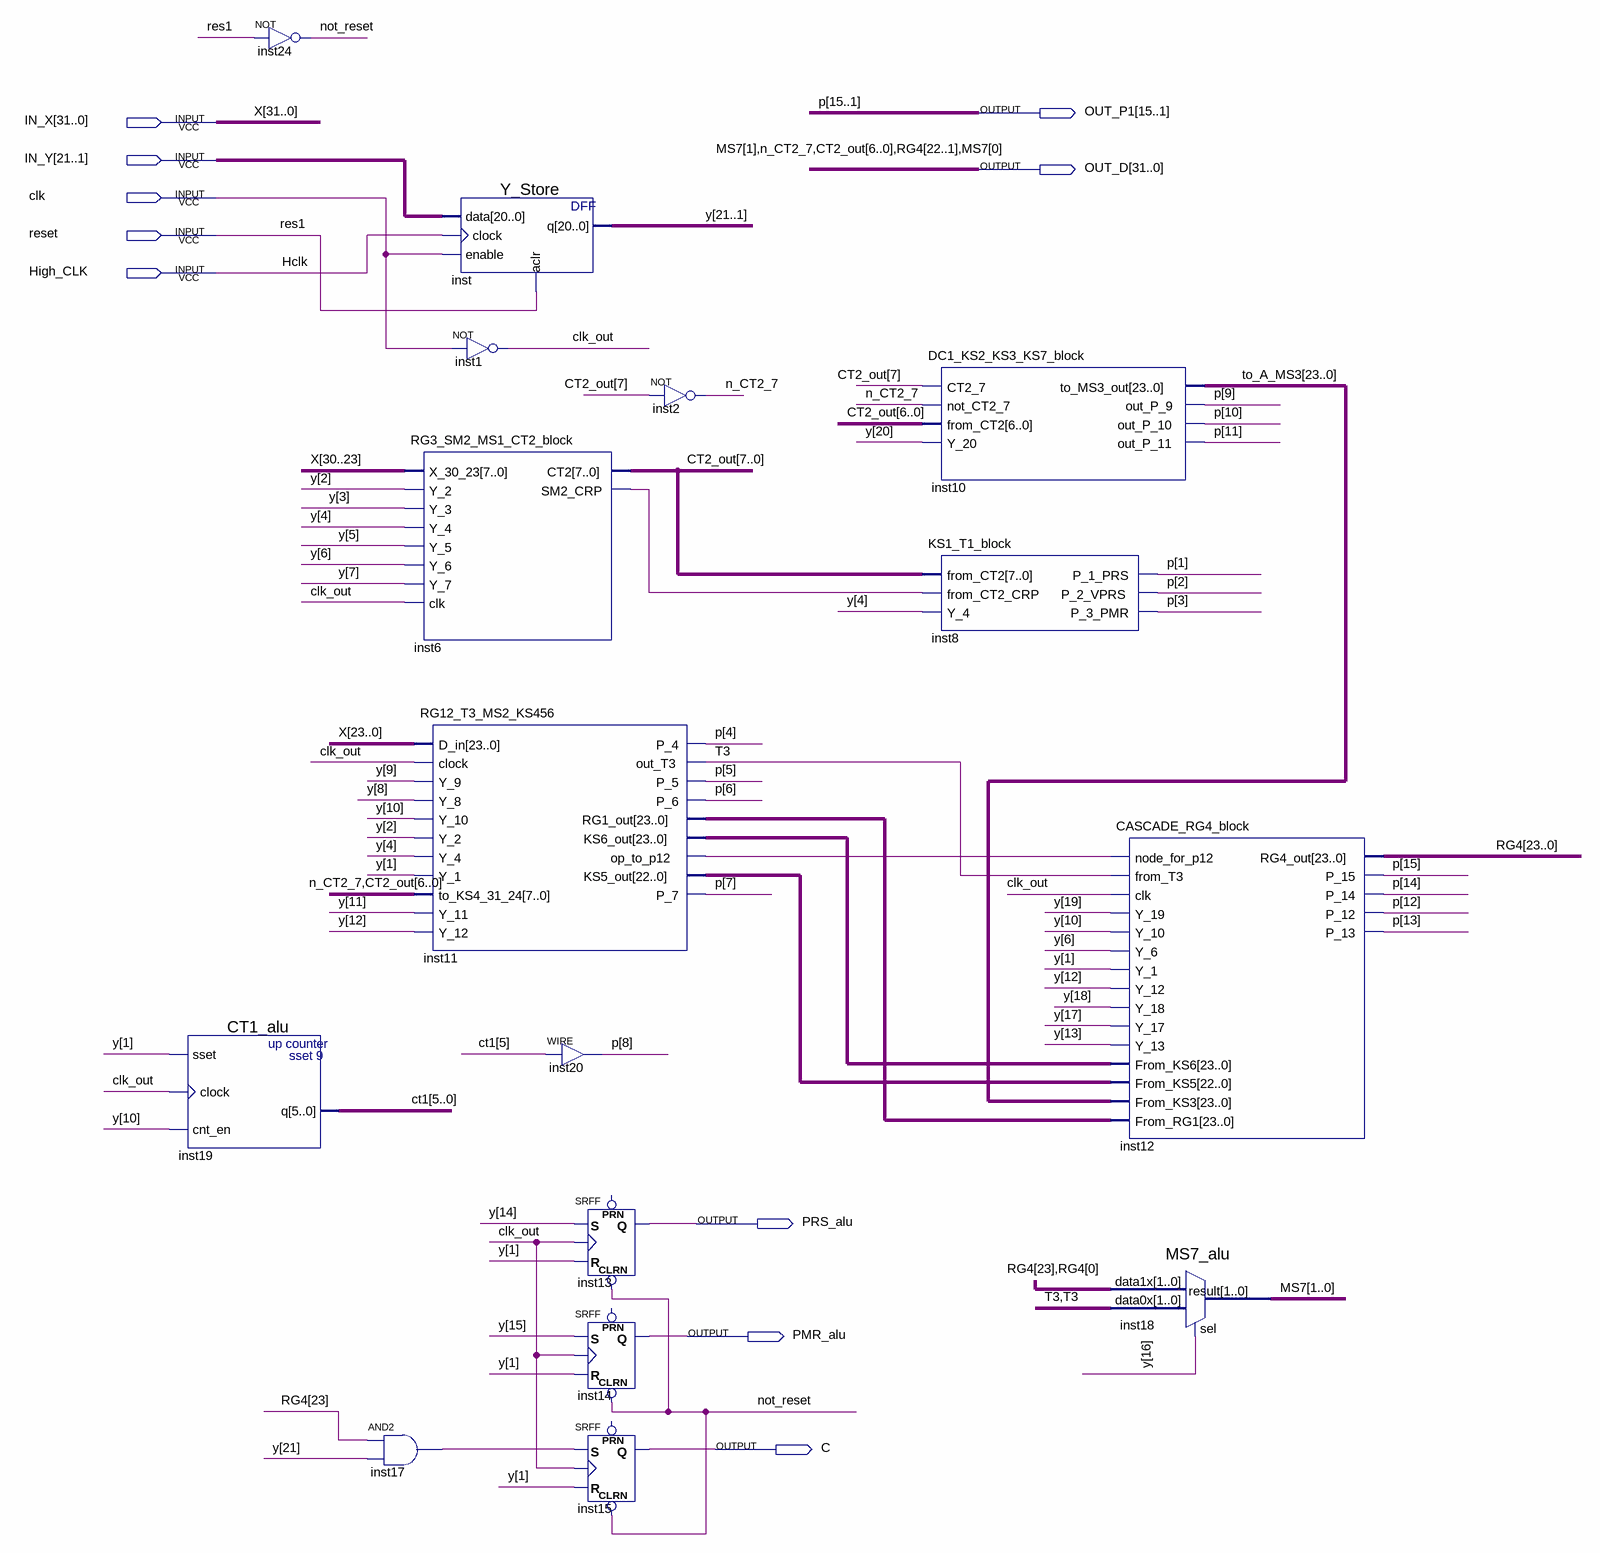
[diagram p0: schematic sheet]
// Quartus schematic ALU.bdf as structural Verilog: 16 symbols, 10 pins
module ALU (
  input  [31:0] IN_X,
  input  [21:1] IN_Y,
  input  clk,
  input  reset,
  input  High_CLK,
  output [15:1] OUT_P1,
  output [31:0] OUT_D,
  output PRS_alu,
  output PMR_alu,
  output C
);

  wire clk_out, inst6_sm2_crp, inst11_op_to_p12, inst17_out, not_reset, T3;
  wire [5:0] ct1;
  wire [7:7] CT2_out;
  wire [21:1] y;
  wire [22:0] inst11_ks5_out;
  wire [23:0] inst11_ks6_out, inst11_rg1_out, RG4, to_A_MS3;

  CT1_alu inst19 (.sset(y[1]), .clock(clk_out), .cnt_en(y[10]), .q(ct1));
  not inst24 (not_reset, reset);
  RG3_SM2_MS1_CT2_block inst6 (
    .X_30_23(IN_X[30:23]), .Y_2(y[2]), .Y_3(y[3]), .Y_4(y[4]), .Y_5(y[5]), .Y_6(y[6]), .Y_7(y[7]),
    .clk(clk_out), .CT2({CT2_out[7], OUT_D[29:23]}), .SM2_CRP(inst6_sm2_crp));
  RG12_T3_MS2_KS456 inst11 (
    .D_in(IN_X[23:0]), .clock(clk_out), .Y_9(y[9]), .Y_8(y[8]), .Y_10(y[10]), .Y_2(y[2]), .Y_4(y[4]),
    .Y_1(y[1]), .to_KS4_31_24(OUT_D[30:23]), .Y_11(y[11]), .Y_12(y[12]), .P_4(OUT_P1[4]), .out_T3(T3),
    .P_5(OUT_P1[5]), .P_6(OUT_P1[6]), .RG1_out(inst11_rg1_out), .KS6_out(inst11_ks6_out),
    .op_to_p12(inst11_op_to_p12), .KS5_out(inst11_ks5_out), .P_7(OUT_P1[7]));
  and inst17 (inst17_out, RG4[23], y[21]);
  Y_Store inst (.data(IN_Y), .clock(High_CLK), .enable(clk), .aclr(reset), .q(y));
  not inst1 (clk_out, clk);
  assign OUT_P1[8] = ct1[5];  // WIRE inst20
  SRFF inst13 (.CLRN(not_reset), .S(y[14]), .R(y[1]), .CLK(clk_out), .Q(PRS_alu));  // open: PRN
  SRFF inst14 (.CLRN(not_reset), .S(y[15]), .R(y[1]), .CLK(clk_out), .Q(PMR_alu));  // open: PRN
  SRFF inst15 (.CLRN(not_reset), .S(inst17_out), .R(y[1]), .CLK(clk_out), .Q(C));  // open: PRN
  not inst2 (OUT_D[30], CT2_out[7]);
  DC1_KS2_KS3_KS7_block inst10 (
    .CT2_7(CT2_out[7]), .not_CT2_7(OUT_D[30]), .from_CT2(OUT_D[29:23]), .Y_20(y[20]), .to_MS3_out(to_A_MS3),
    .out_P_9(OUT_P1[9]), .out_P_10(OUT_P1[10]), .out_P_11(OUT_P1[11]));
  KS1_T1_block inst8 (
    .from_CT2({CT2_out[7], OUT_D[29:23]}), .from_CT2_CRP(inst6_sm2_crp), .Y_4(y[4]), .P_1_PRS(OUT_P1[1]),
    .P_2_VPRS(OUT_P1[2]), .P_3_PMR(OUT_P1[3]));
  CASCADE_RG4_block inst12 (
    .node_for_p12(inst11_op_to_p12), .from_T3(T3), .clk(clk_out), .Y_19(y[19]), .Y_10(y[10]), .Y_6(y[6]),
    .Y_1(y[1]), .Y_12(y[12]), .Y_18(y[18]), .Y_17(y[17]), .Y_13(y[13]), .From_KS6(inst11_ks6_out),
    .From_KS5(inst11_ks5_out), .From_KS3(to_A_MS3), .From_RG1(inst11_rg1_out),
    .RG4_out({RG4[23], OUT_D[22:1], RG4[0]}), .P_15(OUT_P1[15]), .P_14(OUT_P1[14]), .P_12(OUT_P1[12]),
    .P_13(OUT_P1[13]));
  MS7_alu inst18 (.data1x({RG4[23], RG4[0]}), .data0x({2{T3}}), .sel(y[16]), .result({OUT_D[31], OUT_D[0]}));

  // Other names for the same wires on the sheet: CT2_out[6:0] = OUT_D[29:23]; Hclk = High_CLK;
  //   MS7[1:0] = {OUT_D[31], OUT_D[0]}; n_CT2_7 = OUT_D[30]; p[15:1] = OUT_P1; res1 = reset; RG4[22:1] = OUT_D[22:1];
  //   X[31:0] = IN_X
endmodule
